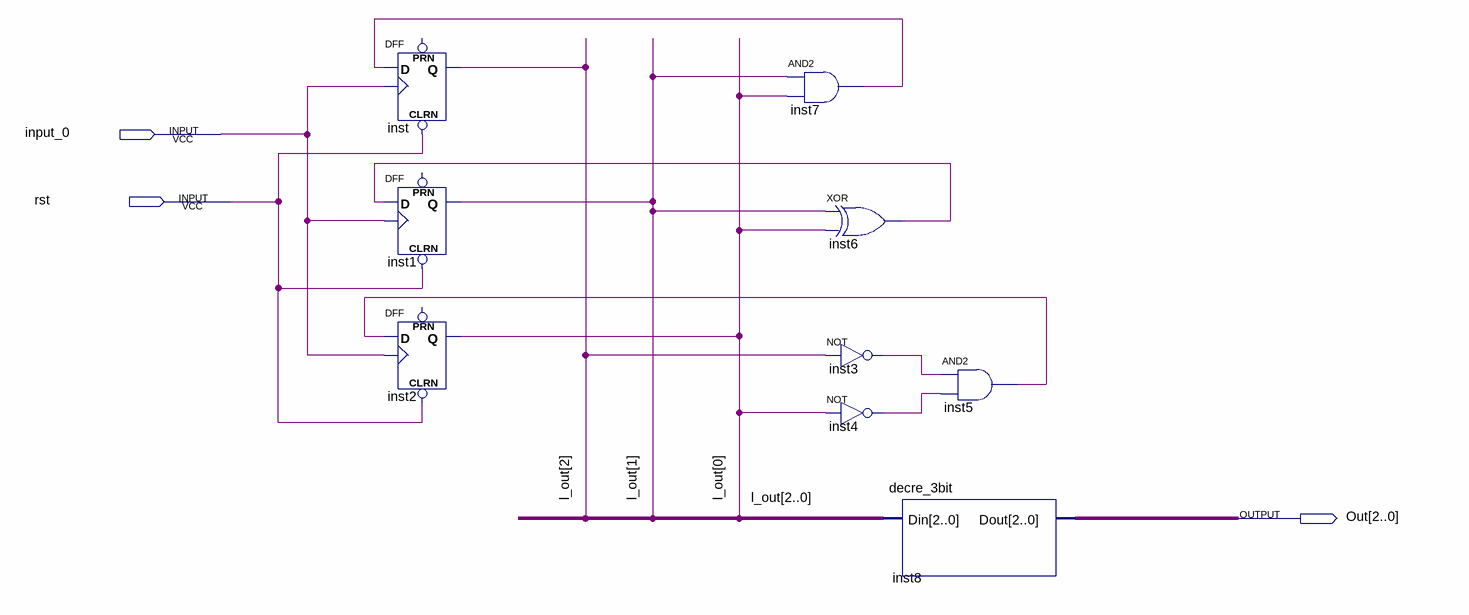
[diagram p0: schematic sheet]
// Quartus schematic count_5.bdf as structural Verilog: 9 symbols, 3 pins
module count_5 (
  input  input_0,
  input  rst,
  output [2:0] Out
);

  wire inst3_out, inst4_out, inst5_out, inst6_out, inst7_out;
  wire [2:0] l_out;

  DFF inst (.CLRN(rst), .CLK(input_0), .D(inst7_out), .Q(l_out[2]));  // open: PRN
  DFF inst1 (.CLRN(rst), .CLK(input_0), .D(inst6_out), .Q(l_out[1]));  // open: PRN
  DFF inst2 (.CLRN(rst), .CLK(input_0), .D(inst5_out), .Q(l_out[0]));  // open: PRN
  and inst7 (inst7_out, l_out[1], l_out[0]);
  xor inst6 (inst6_out, l_out[1], l_out[0]);
  not inst3 (inst3_out, l_out[2]);
  not inst4 (inst4_out, l_out[0]);
  and inst5 (inst5_out, inst3_out, inst4_out);
  decre_3bit inst8 (.Din(l_out), .Dout(Out));
endmodule
